# Altium schematic sheet 2_FPGA.schdoc
size 340 x 314 mm; Symbol: Drawing-Symbol_A4; Device: Drawing-Symbol_A4; @Project Name: Ai-Camera; @Page Count: 2; @Update Date: 2026-02-07; @Create Date: 2026-01-28; @Schematic Name: Schematic1; @Page No: 2; @Page Name: FPGA; Company: EasyEDA.com; Version: V1.0; Page Size: A4; @Create Time: 04:50:03; @Update Time: 05:36:30; Width: 1300; Height: 1200; Region Start: 1; X Region Count: 6; Y Region Count: 4; Blade Width: 10; Title Block Position: 3; @Board Name: Board1
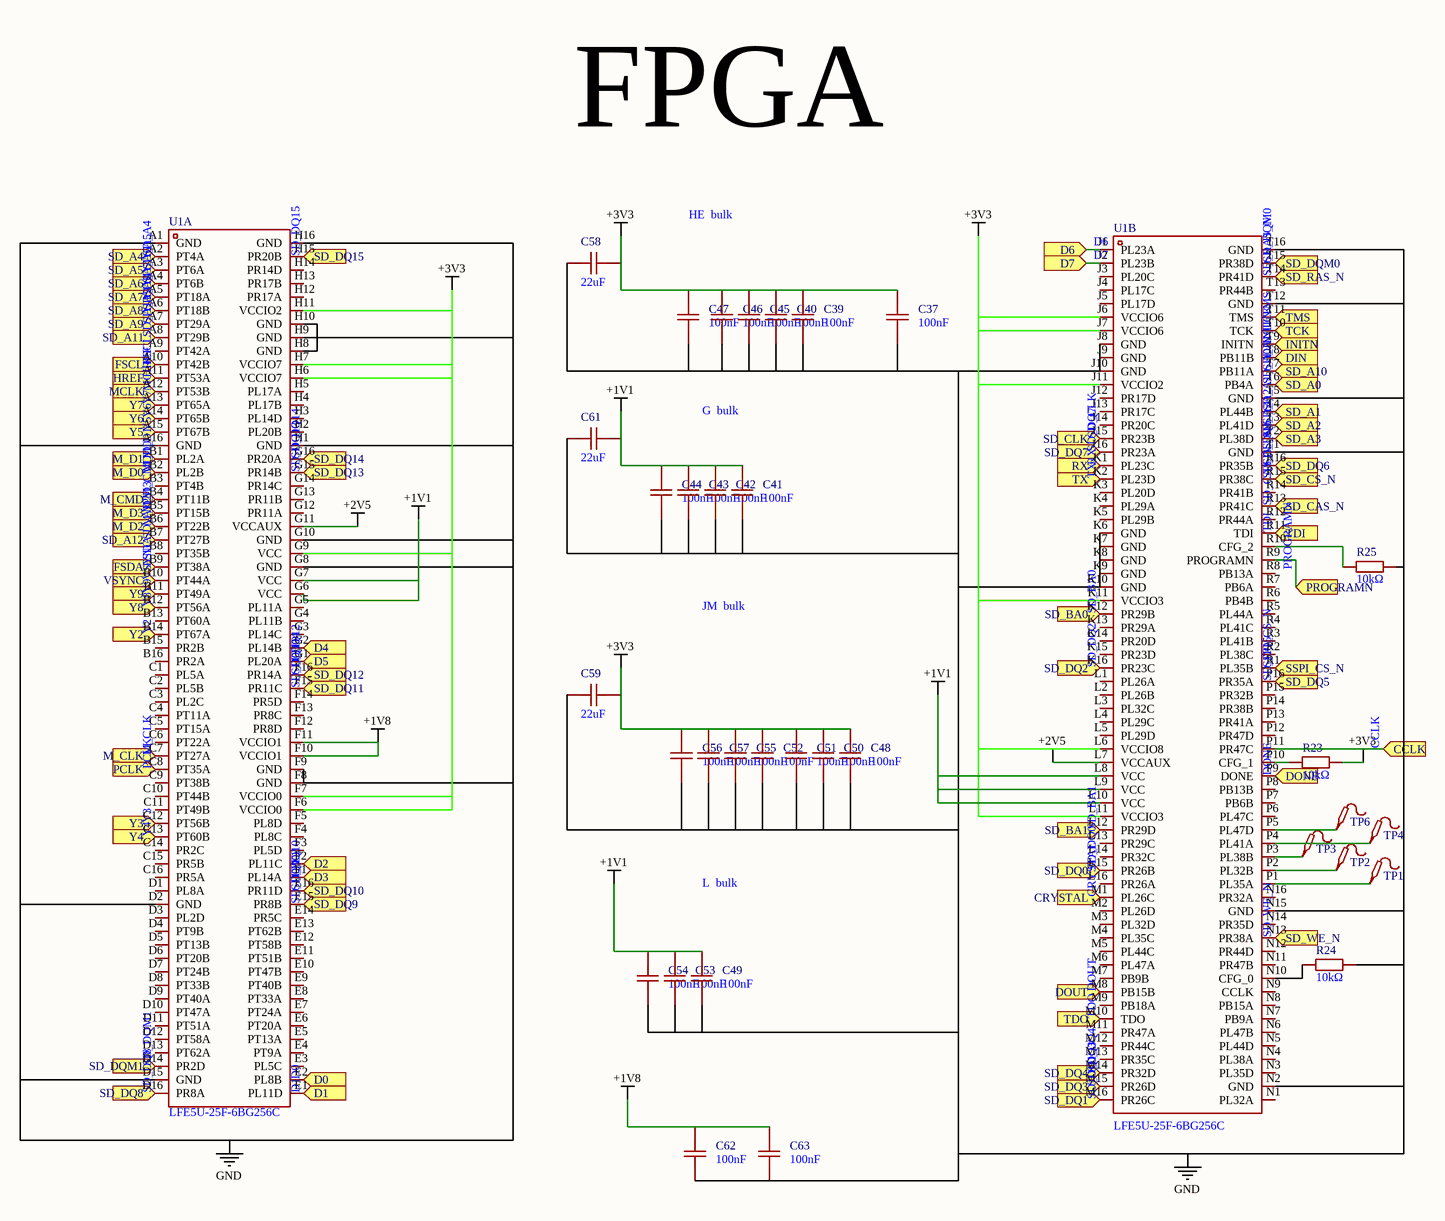
[diagram p0: 2_FPGA.schdoc]

## Parts
C37  100nF  [C01005]
C39  100nF  [C01005]
C40  100nF  [C01005]
C41  100nF  [C01005]
C42  100nF  [C01005]
C43  100nF  [C01005]
C44  100nF  [C01005]
C45  100nF  [C01005]
C46  100nF  [C01005]
C47  100nF  [C01005]
C48  100nF  [C01005]
C49  100nF  [C01005]
C50  100nF  [C01005]
C51  100nF  [C01005]
C52  100nF  [C01005]
C53  100nF  [C01005]
C54  100nF  [C01005]
C55  100nF  [C01005]
C56  100nF  [C01005]
C57  100nF  [C01005]
C58  22uF  [C0603]
C59  22uF  [C0603]
C61  22uF  [C0603]
C62  100nF  [C01005]
C63  100nF  [C01005]
R23  10kΩ  [R0402]
R24  10kΩ  [R0402]
R25  10kΩ  [R0402]
TP1  (no value)  [Test-Point-0.5mm]
TP2  (no value)  [Test-Point-0.5mm]
TP3  (no value)  [Test-Point-0.5mm]
TP4  (no value)  [Test-Point-0.5mm]
TP6  (no value)  [Test-Point-0.5mm]
U1  LFE5U-25F-6BG256C  [CABGA-256_L14.0-W14.0-R16-C16-P0.80-TL]  (parts A,B of 2)

## Ports
CCLK (in), CRYSTAL (in), D0 (in), D1 (in), D2 (in), D3 (in), D4 (in), D5 (in), D6 (in), D7 (in), DIN (in), DONE (in), DOUT (in), FSCL (in), FSDA (in), HREF (in), INITN (in), M_CLK (in), M_CMD (in), M_D0 (in), M_D1 (in), M_D2 (in), M_D3 (in), MCLK (in), PCLK (in), PROGRAMN (in), RX (in), SD_A0 (in), SD_A1 (in), SD_A2 (in), SD_A3 (in), SD_A4 (in), SD_A5 (in), SD_A6 (in), SD_A7 (in), SD_A8 (in), SD_A9 (in), SD_A10 (in), SD_A11 (in), SD_A12 (in), SD_BA0 (in), SD_BA1 (in), SD_CAS_N (in), SD_CLK (in), SD_CS_N (in), SD_DQ0 (in), SD_DQ1 (in), SD_DQ2 (in), SD_DQ3 (in), SD_DQ4 (in), SD_DQ5 (in), SD_DQ6 (in), SD_DQ7 (in), SD_DQ8 (in), SD_DQ9 (in), SD_DQ10 (in), SD_DQ11 (in), SD_DQ12 (in), SD_DQ13 (in), SD_DQ14 (in), SD_DQ15 (in), SD_DQM0 (in), SD_DQM1 (in), SD_RAS_N (in), SD_WE_N (in), SSPI_CS_N (in), TCK (in), TDI (in), TDO (in), TMS (in), TX (in), VSYNC (in), Y2 (in), Y3 (in), Y4 (in), Y5 (in), Y6 (in), Y7 (in), Y8 (in), Y9 (in)

## Nets
+1V1: C41.1 C42.1 C43.1 C44.1 C49.1 C53.1 C54.1 C61.1 U1.G6(VCC) U1.G7(VCC) U1.L8(VCC) U1.L9(VCC) U1.L10(VCC)
+1V8: C62.1 C63.1 U1.F10(VCCIO1) U1.F11(VCCIO1)
+2V5: U1.G11(VCCAUX) U1.L7(VCCAUX)
+3V3: C37.1 C39.1 C40.1 C45.1 C46.1 C47.1 C48.1 C50.1 C51.1 C52.1 C55.1 C56.1 C57.1 C58.1 C59.1 R23.1 U1.F6(VCCIO0) U1.F7(VCCIO0) U1.G9(VCC) U1.H6(VCCIO7) U1.H7(VCCIO7) U1.H11(VCCIO2) U1.J6(VCCIO6) U1.J7(VCCIO6) U1.J11(VCCIO2) U1.K11(VCCIO3) U1.L6(VCCIO8) U1.L11(VCCIO3)
GND: C37.2 C39.2 C40.2 C41.2 C42.2 C43.2 C44.2 C45.2 C46.2 C47.2 C48.2 C49.2 C50.2 C51.2 C52.2 C53.2 C54.2 C55.2 C56.2 C57.2 C58.2 C59.2 C61.2 C62.2 C63.2 R24.1 R25.1 U1.A1(GND) U1.A16(GND) U1.D2(GND) U1.D15(GND) U1.F8(GND) U1.F9(GND) U1.G8(GND) U1.G10(GND) U1.H1(GND) U1.H8(GND) U1.H9(GND) U1.H10(GND) U1.H16(GND) U1.J8(GND) U1.J9(GND) U1.J10(GND) U1.K6(GND) U1.K7(GND) U1.K8(GND) U1.K9(GND) U1.K10(GND) U1.N2(GND) U1.N15(GND) U1.T1(GND) U1.T5(GND) U1.T12(GND) U1.T16(GND)
CCLK: U1.P11(PR47C) ; port CCLK
CRYSTAL: U1.M1(PL26C) ; port CRYSTAL
D0: U1.E2(PL8B) ; port D0
D1: U1.E1(PL11D) ; port D1
D2: U1.F2(PL11C) ; port D2
D3: U1.F1(PL14A) ; port D3
D4: U1.G2(PL14B) ; port D4
D5: U1.G1(PL20A) ; port D5
D6: U1.J1(PL23A) ; port D6
D7: U1.J2(PL23B) ; port D7
DIN: U1.T8(PB11B) ; port DIN
DONE: U1.P9(DONE) ; port DONE
DOUT: U1.M8(PB15B) ; port DOUT
FSCL: U1.A10(PT42B) ; port FSCL
FSDA: U1.B9(PT38A) ; port FSDA
HREF: U1.A11(PT53A) ; port HREF
INITN: U1.T9(INITN) ; port INITN
M_CLK: U1.C7(PT27A) ; port M_CLK
M_CMD: U1.B4(PT11B) ; port M_CMD
M_D0: U1.B2(PL2B) ; port M_D0
M_D1: U1.B1(PL2A) ; port M_D1
M_D2: U1.B6(PT22B) ; port M_D2
M_D3: U1.B5(PT15B) ; port M_D3
MCLK: U1.A12(PT53B) ; port MCLK
PCLK: U1.C8(PT35A) ; port PCLK
PROGRAMN: U1.R9(PROGRAMN) ; port PROGRAMN
RX: U1.K1(PL23C) ; port RX
SD_A0: U1.T6(PB4A) ; port SD_A0
SD_A1: U1.T4(PL44B) ; port SD_A1
SD_A2: U1.T3(PL41D) ; port SD_A2
SD_A3: U1.T2(PL38D) ; port SD_A3
SD_A4: U1.A2(PT4A) ; port SD_A4
SD_A5: U1.A3(PT6A) ; port SD_A5
SD_A6: U1.A4(PT6B) ; port SD_A6
SD_A7: U1.A5(PT18A) ; port SD_A7
SD_A8: U1.A6(PT18B) ; port SD_A8
SD_A9: U1.A7(PT29A) ; port SD_A9
SD_A10: U1.T7(PB11A) ; port SD_A10
SD_A11: U1.A8(PT29B) ; port SD_A11
SD_A12: U1.B7(PT27B) ; port SD_A12
SD_BA0: U1.K12(PR29B) ; port SD_BA0
SD_BA1: U1.L12(PR29D) ; port SD_BA1
SD_CAS_N: U1.R13(PR41C) ; port SD_CAS_N
SD_CLK: U1.J15(PR23B) ; port SD_CLK
SD_CS_N: U1.R15(PR38C) ; port SD_CS_N
SD_DQ0: U1.L15(PR26B) ; port SD_DQ0
SD_DQ1: U1.M16(PR26C) ; port SD_DQ1
SD_DQ2: U1.K16(PR23C) ; port SD_DQ2
SD_DQ3: U1.M15(PR26D) ; port SD_DQ3
SD_DQ4: U1.M14(PR32D) ; port SD_DQ4
SD_DQ5: U1.P16(PR35A) ; port SD_DQ5
SD_DQ6: U1.R16(PR35B) ; port SD_DQ6
SD_DQ7: U1.J16(PR23A) ; port SD_DQ7
SD_DQ8: U1.D16(PR8A) ; port SD_DQ8
SD_DQ9: U1.E15(PR8B) ; port SD_DQ9
SD_DQ10: U1.E16(PR11D) ; port SD_DQ10
SD_DQ11: U1.F15(PR11C) ; port SD_DQ11
SD_DQ12: U1.F16(PR14A) ; port SD_DQ12
SD_DQ13: U1.G15(PR14B) ; port SD_DQ13
SD_DQ14: U1.G16(PR20A) ; port SD_DQ14
SD_DQ15: U1.H15(PR20B) ; port SD_DQ15
SD_DQM0: U1.T15(PR38D) ; port SD_DQM0
SD_DQM1: U1.D14(PR2D) ; port SD_DQM1
SD_RAS_N: U1.T14(PR41D) ; port SD_RAS_N
SD_WE_N: U1.N13(PR38A) ; port SD_WE_N
SSPI_CS_N: U1.R1(PL35B) ; port SSPI_CS_N
TCK: U1.T10(TCK) ; port TCK
TDI: U1.R11(TDI) ; port TDI
TDO: U1.M10(TDO) ; port TDO
TMS: U1.T11(TMS) ; port TMS
TX: U1.K2(PL23D) ; port TX
VSYNC: U1.B10(PT44A) ; port VSYNC
Y2: U1.B14(PT67A) ; port Y2
Y3: U1.C12(PT56B) ; port Y3
Y4: U1.C13(PT60B) ; port Y4
Y5: U1.A15(PT67B) ; port Y5
Y6: U1.A14(PT65B) ; port Y6
Y7: U1.A13(PT65A) ; port Y7
Y8: U1.B12(PT56A) ; port Y8
Y9: U1.B11(PT49A) ; port Y9
NetR23_2: R23.2 U1.P10(CFG_1)
NetR24_2: R24.2 U1.N10(CFG_0)
NetR25_2: R25.2 U1.R10(CFG_2)
NetTP1_1: TP1.1 U1.P1(PL35A)
NetTP2_1: TP2.1 U1.P2(PL32B)
NetTP3_1: TP3.1 U1.P3(PL38B)
NetTP4_1: TP4.1 U1.P4(PL41A)
NetTP6_1: TP6.1 U1.P5(PL47D)

Not connected (* = marked no-connect by the designer): U1 A9(PT42A) B3(PT4B) B8(PT35B) B13(PT60A) B15(PR2B) B16(PR2A) C1(PL5A) C2(PL5B) C3(PL2C) C4(PT11A) C5(PT15A) C6(PT22A) C9(PT38B) C10(PT44B) C11(PT49B) C14(PR2C) C15(PR5B) C16(PR5A) D1(PL8A) D3(PL2D) D4(PT9B) D5(PT13B) D6(PT20B) D7(PT24B) D8(PT33B) D9(PT40A) D10(PT47A) D11(PT51A) D12(PT58A) D13(PT62A) E3(PL5C) E4(PT9A) E5(PT13A) E6(PT20A) E7(PT24A) E8(PT33A) E9(PT40B) E10(PT47B) E11(PT51B) E12(PT58B) E13(PT62B) E14(PR5C) F3(PL5D) F4(PL8C) F5(PL8D) F12(PR8D) F13(PR8C) F14(PR5D) G3(PL14C) G4(PL11B) G5(PL11A) G12(PR11A) G13(PR11B) G14(PR14C) H2(PL20B) H3(PL14D) H4(PL17B) H5(PL17A) H12(PR17A) H13(PR17B) H14(PR14D) J3(PL20C) J4(PL17C) J5(PL17D) J12(PR17D) J13(PR17C) J14(PR20C) K3(PL20D) K4(PL29A) K5(PL29B) K13(PR29A) K14(PR20D) K15(PR23D) L1(PL26A) L2(PL26B) L3(PL32C) L4(PL29C) L5(PL29D) L13(PR29C) L14(PR32C) L16(PR26A) M2(PL26D) M3(PL32D) M4(PL35C) M5(PL44C) M6(PL47A) M7(PB9B) M9(PB18A) M11(PR47A) M12(PR44C) M13(PR35C) N1(PL32A) N3(PL35D) N4(PL38A) N5(PL44D) N6(PL47B) N7(PB9A) N8(PB15A) N9(CCLK) N11(PR47B) N12(PR44D) N14(PR35D) N16(PR32A) P6(PL47C) P7(PB6B) P8(PB13B) P12(PR47D) P13(PR41A) P14(PR38B) P15(PR32B) R2(PL38C) R3(PL41B) R4(PL41C) R5(PL44A) R6(PB4B) R7(PB6A) R8(PB13A) R12(PR44A) R14(PR41B) T13(PR44B)

## Notes on the sheet
- FPGA
- HE  bulk
- G  bulk
- JM  bulk
- L  bulk
- 1
- 2
- 3
- 4
- 5
- 6
- A
- B
- C
- Schematic
- Schematic1
- Create at
- Update at
- 2026-01-28
- 2026-02-07
- D
- Board
- Drawn
- Board1
- Page
- Reviewed
- Version
- Size
- Ai-Camera
- Page  2  Total  2
- V1.0
- A4
- EasyEDA.com

## Library data of the parts
C37 C39-C57 C62 C63 = GRM022R60J104KE15D: Manufacturer: muRata(村田); Add into BOM: yes; Tolerance: ±10%; Voltage Rating: 6.3V; Temperature Coefficient: X5R; Symbol: GRM022R60J104KE15D; Device: GRM022R60J104KE15D; LCSC Part Name: 100nF ±10% 6.3V; Supplier Part: C161362; Manufacturer Part: GRM022R60J104KE15D; Supplier Footprint: 01005; JLCPCB Part Class: Extended Part; Datasheet: https://atta.szlcsc.com/upload/public/pdf/source/20200305/C490387_23319AE8C154DEB24C505E6C82A8106A.pdf; Supplier: LCSC; Convert to PCB: yes; Value: 100nF
C58 C59 C61 = TCC0603X5R226M6R3CT: Manufacturer: CCTC(三环); Add into BOM: yes; Tolerance: ±20%; Voltage Rating: 6.3V; Temperature Coefficient: X5R; Symbol: TCC0603X5R226M6R3CT; Device: TCC0603X5R226M6R3CT; LCSC Part Name: 22uF ±20% 6.3V; Supplier Part: C380323; Manufacturer Part: TCC0603X5R226M6R3CT; Supplier Footprint: 0603; JLCPCB Part Class: Extended Part; Datasheet: https://item.szlcsc.com/datasheet/TCC0603X5R226M6R3CT/352728.html; Supplier: LCSC; Convert to PCB: yes; Value: 22uF
R23-R25 = 0402WGF1002TCE: Manufacturer: UNI-ROYAL(厚声); Add into BOM: yes; Tolerance: ±1%; Power(Watts): 62.5mW; Voltage-Supply(Max): 50V; Temperature Coefficient: ±100ppm/℃; Symbol: 0402WGF1002TCE; Device: 0402WGF1002TCE; LCSC Part Name: 10kΩ ±1% 62.5mW 厚膜电阻; Supplier Part: C25744; Manufacturer Part: 0402WGF1002TCE; Supplier Footprint: 0402; JLCPCB Part Class: Basic Part; Datasheet: https://item.szlcsc.com/datasheet/0402WGF1002TCE/26487.html; Supplier: LCSC; Convert to PCB: yes; Type: Thick Film Resistor; Value: 10kΩ; Operating Temperature: -55℃~+155℃
TP1-TP4 TP6 = Test-Point: Add into BOM: yes; Symbol: Test-Point; Device: Test-Point; Convert to PCB: yes
U1 = LFE5U-25F-6BG256C: Manufacturer: LATTICE(莱迪思); Add into BOM: yes; Logic Elements / Cells: 24000; Logic Array Blocks: 6000; Embedded Block RAM: 1032192bit; Relevance: []; Symbol: LFE5U-25F-6BG256C; Device: LFE5U-25F-6BG256C; LCSC Part Name: LFE5U 25F 6BG256C; Supplier Part: C1521614; Manufacturer Part: LFE5U-25F-6BG256C; Supplier Footprint: CABGA-256; JLCPCB Part Class: Extended Part; Datasheet: https://atta.szlcsc.com/upload/public/pdf/source/20221202/6704A1754335A6F4ED4829569A52AB14.pdf; Supplier: LCSC; Convert to PCB: yes; Type: -; Number of Logic Gates: -; Supply Voltage Range - VCCIO: -; Maximum Delay Time Tpd: -; Operating Temperature Range: 0℃~+85℃